# EasyEDA schematic 1-Schematic_ISMWAVER315_MODULE.json
TITLE: Sheet_1; REV: 1.0; Date: 2022-12-25; Sheet: 1/1; Drawn By: maarnotto; Company: Your Company
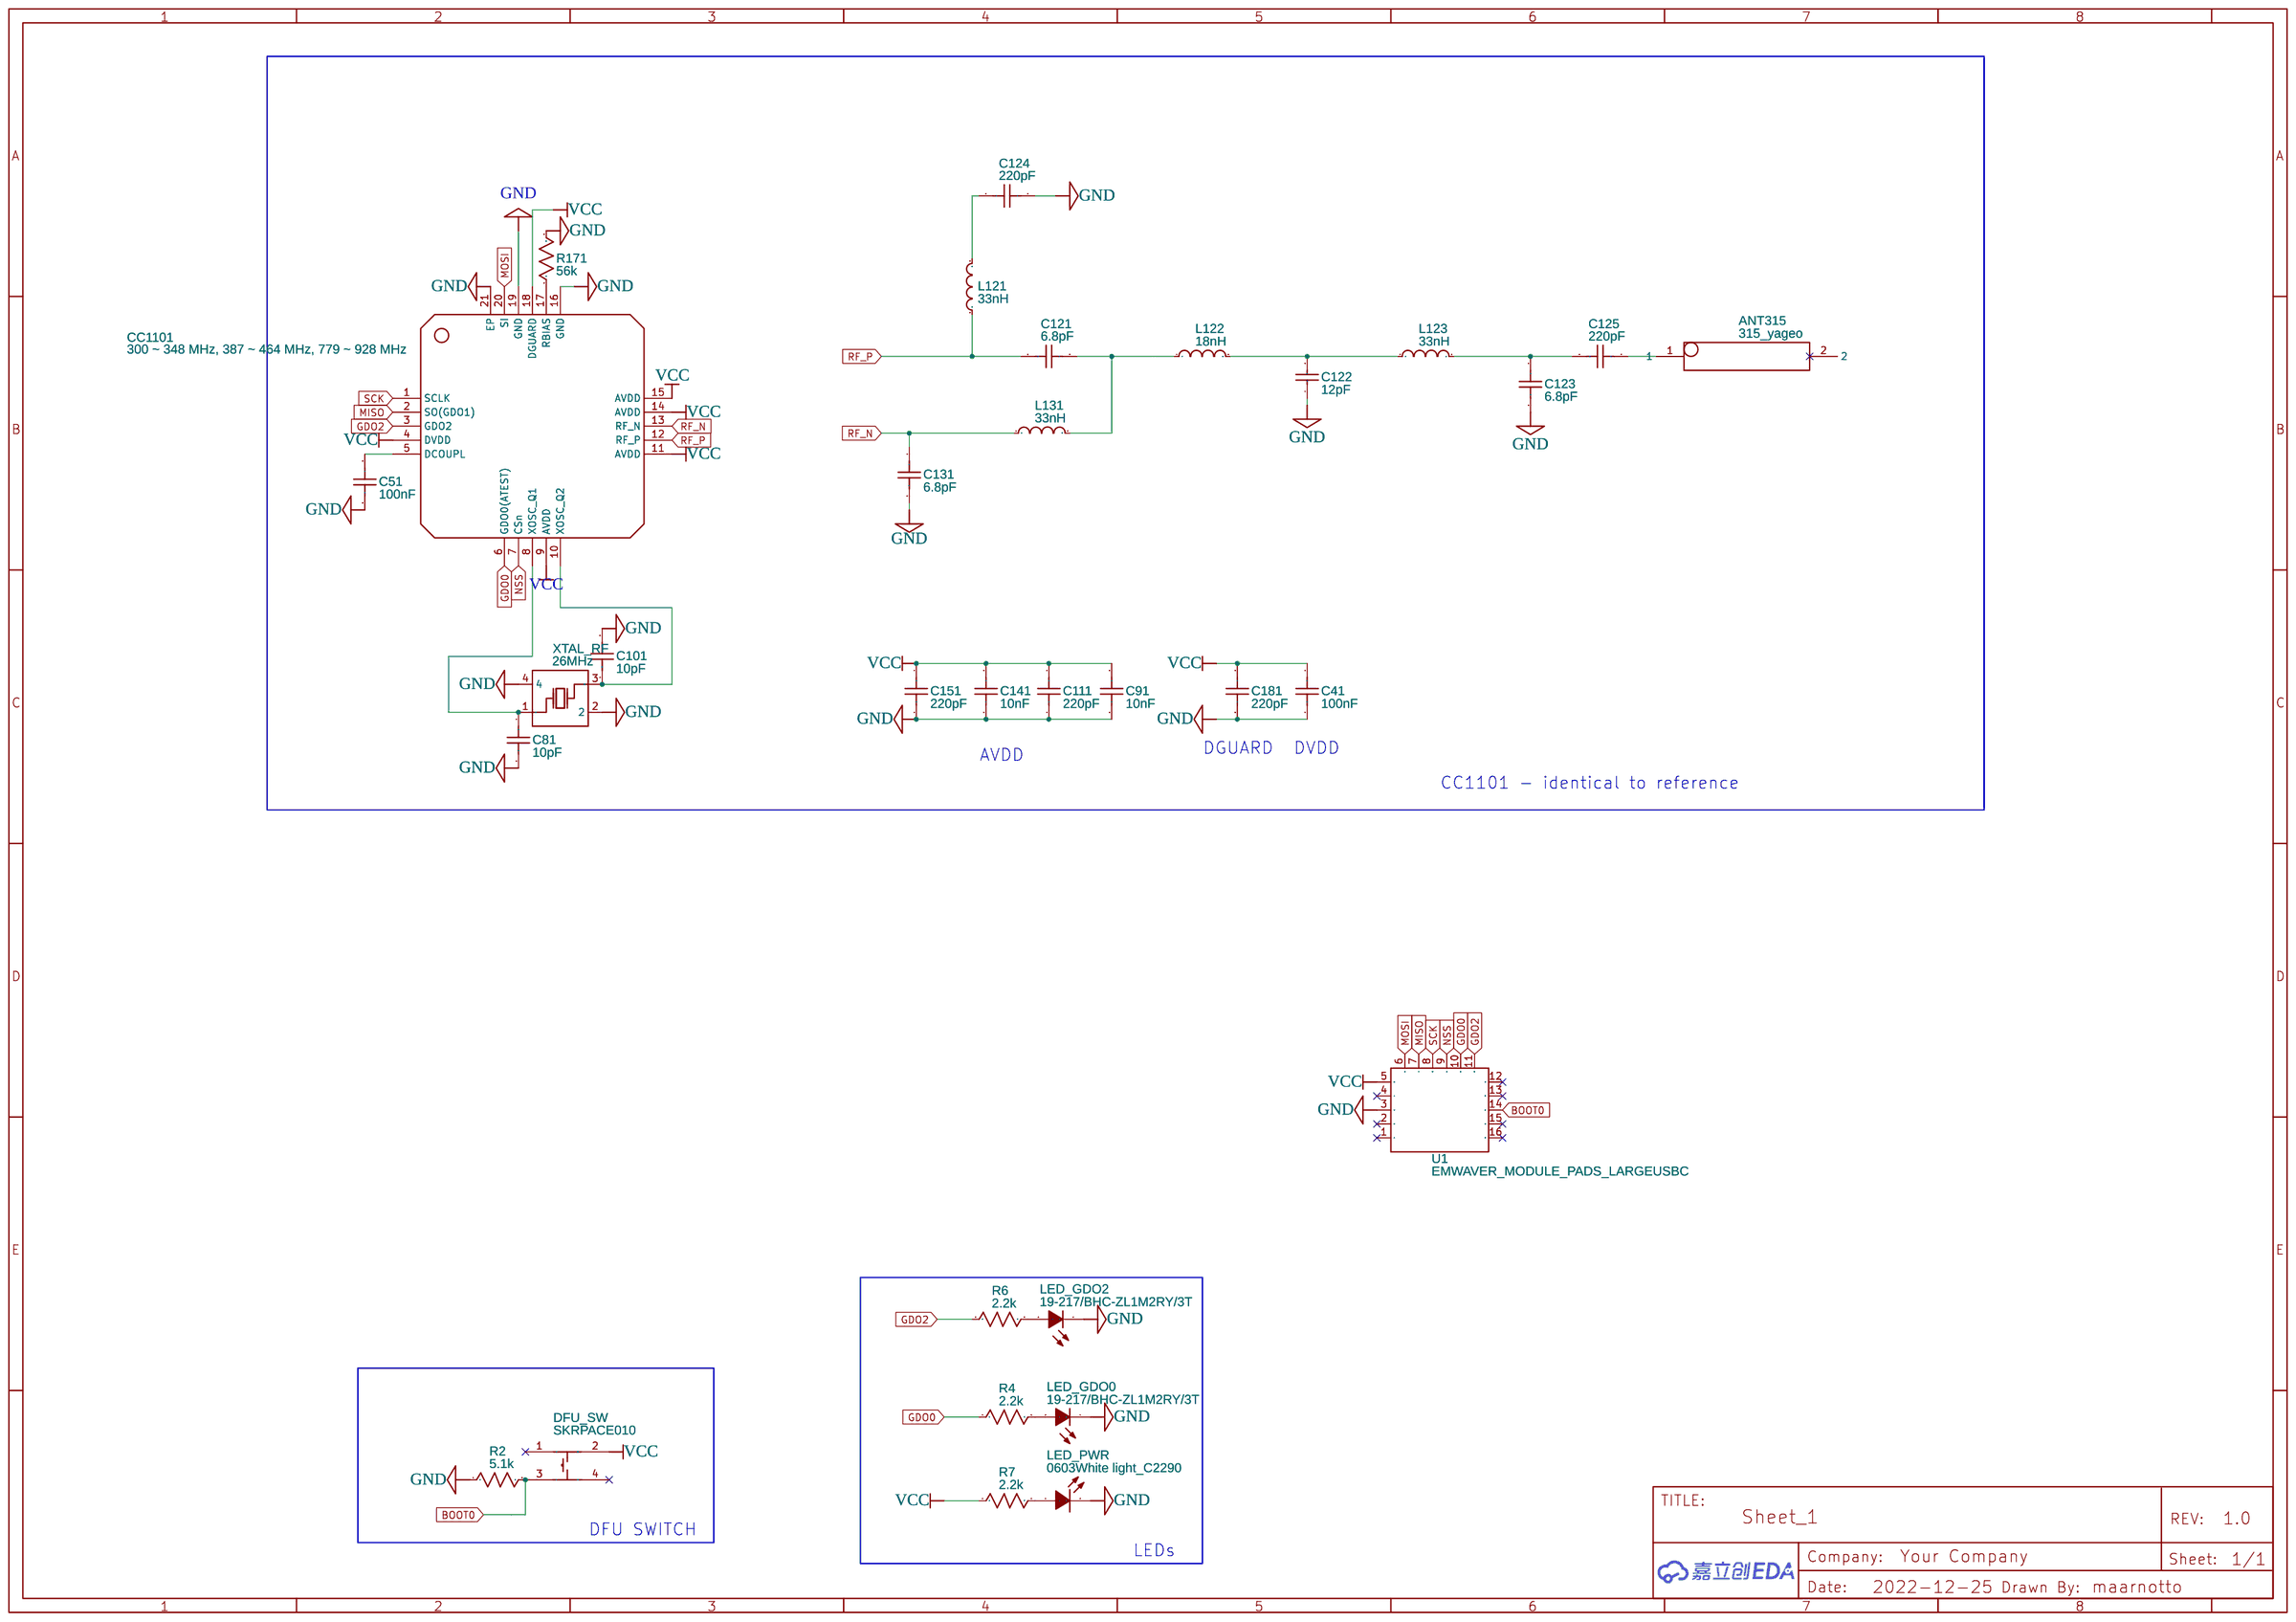
[diagram p0: schematic sheet]

## Parts
ANT315  315_yageo  [315_YAGEO]
C41  100nF  [C0402]
C51  100nF  [C0402]
C81  10pF  [C0402]
C91  10nF  [C0402]
C101  10pF  [C0402]
C111  220pF  [C0402]
C121  6.8pF  [C0402]
C122  12pF  [C0402]
C123  6.8pF  [C0402]
C124  220pF  [C0402]
C125  220pF  [C0402]
C131  6.8pF  [C0402]
C141  10nF  [C0402]
C151  220pF  [C0402]
C181  220pF  [C0402]
CC1101  300 ~ 348 MHz, 387 ~ 464 MHz, 779 ~ 928 MHz  [QFN-20_L4.0-W4.0-P0.5-TL-EP]
DFU_SW  SKRPACE010  [KEY-SMD_4P-L4.2-W3.2-P2.20-LS4.6]
L121  33nH  [L0402]
L122  18nH  [L0402]
L123  33nH  [L0402]
L131  33nH  [L0402]
LED_GDO0  19-217/BHC-ZL1M2RY/3T  [LED0603-RD]
LED_GDO2  19-217/BHC-ZL1M2RY/3T  [LED0603-RD]
LED_PWR  0603White light_C2290  [LED0603-R-RD_WHITE]
R2  5.1k  [R0603]
R4  2.2k  [R0603]
R6  2.2k  [R0603]
R7  2.2k  [R0603]
R171  56k  [R0402]
U1  EMWAVER_MODULE_PADS_LARGEUSBC  [EMWAVER_MODULE_PADS_FOOTPRINT_LARGEUSBC]
XTAL_RF  26MHz  [CRYSTAL-SMD_4P-L3.2-W2.5-BL]

## Library data of the parts
ANT315 = 315_yageo: Manufacturer: PULSE ELECTRONICS; Manufacturer Part: ANT1204F002R0315A; Supplier: LCSC; Supplier Part: C3284059; link: https://jlcpcb.com/partdetail/PulseElectronics-ANT1204F002R0315A/C3284059; Contributor: maarnotto
C41 C51 C81 C91 C101 C111 C121 C123-C125 C131 C141 C151 C181 = C_0402_US: Contributor: LCEDA_Lib
C122 = 0402CG8R2C500NT: Supplier: LCSC; Manufacturer: FH(风华); Supplier Part: C1579; JLCPCB Part Class: Extended Part
CC1101 = CC1101RGPR: Supplier: LCSC; Manufacturer: TI(德州仪器); Supplier Part: C29953; JLCPCB Part Class: Extended Part
DFU_SW = SKRPACE010: Contributor: LCSC; Supplier: LCSC; Manufacturer: ALPSALPINE(阿尔卑斯阿尔派); Supplier Part: C139797; JLCPCB Part Class: Extended Part
L121-L123 L131 = L0402_US: Supplier Part: C14033; Contributor: LCEDA_Lib
LED_GDO0 LED_GDO2 = 19-217/BHC-ZL1M2RY/3T: Supplier: LCSC; Manufacturer: EVERLIGHT(亿光); Supplier Part: C72041; JLCPCB Part Class: Basic Part
LED_PWR = 0603White light_C2290: Supplier: LCSC; Manufacturer: null; Manufacturer Part: KT-0603白灯; Supplier Part: C2290; JLCPCB Part Class: Basic Part
R2 R4 R6 R7 = R_0603_US: Contributor: LCEDA_Lib
R171 = R_0402_US: Contributor: LCEDA_Lib
U1 = EMWAVER_MODULE_PADS_LARGEUSBC: Contributor: maarnotto
XTAL_RF = 3S26000333: Supplier: LCSC; Supplier Part: C431163; Manufacturer: YL(惠伦晶体); Contributor: LCSC; JLCPCB Part Class: Extended Part

## Nets
GND: C41.2 C51.2 C81.2 C91.2 C101.2 C111.2 C122.1 C123.2 C124.1 C131.2 C141.2 C151.2 C181.2 CC1101.16(GND) CC1101.19(GND) CC1101.21(EP) LED_GDO0.1(C) LED_GDO2.1(C) LED_PWR.2(K) R2.1 R171.2 U1.3 XTAL_RF.2 XTAL_RF.4
VCC: C41.1 C91.1 C111.1 C141.1 C151.1 C181.1 CC1101.4(DVDD) CC1101.9(AVDD) CC1101.11(AVDD) CC1101.14(AVDD) CC1101.15(AVDD) CC1101.18(DGUARD) DFU_SW.2 R7.1 U1.5
BOOT0: DFU_SW.3 R2.2 U1.14
GDO0: CC1101.6(GDO0(ATEST)) R4.1 U1.10
GDO2: CC1101.3(GDO2) R6.1 U1.11
MISO: CC1101.2(SO(GDO1)) U1.7
MOSI: CC1101.20(SI) U1.6
NSS: CC1101.7(CSn) U1.9
RF_N: C131.1 CC1101.13(RF_N) L131.1
RF_P: C121.2 CC1101.12(RF_P) L121.1
SCK: CC1101.1(SCLK) U1.8
Net-(ANT315-1): ANT315.1 C125.1
Net-(C51-1): C51.1 CC1101.5(DCOUPL)
Net-(C81-1): C81.1 CC1101.8(XOSC_Q1) XTAL_RF.1(OSC1)
Net-(C101-1): C101.1 CC1101.10(XOSC_Q2) XTAL_RF.3(OSC2)
Net-(C121-1): C121.1 L122.1 L131.2
Net-(C122-2): C122.2 L122.2 L123.1
Net-(C123-1): C123.1 C125.2 L123.2
Net-(C124-2): C124.2 L121.2
Net-(CC1101-17): CC1101.17(RBIAS) R171.1
Net-(LED_GDO0-2): LED_GDO0.2(A) R4.2
Net-(LED_GDO2-2): LED_GDO2.2(A) R6.2
Net-(LED_PWR-1): LED_PWR.1(A) R7.2

Not connected (* = marked no-connect by the designer): ANT315 2*; DFU_SW 1* 4*; U1 1* 2* 4* 12* 13* 15* 16*

## Notes on the sheet
- AVDD
- DGUARD
- DVDD
- CC1101 - identical to reference
- DFU SWITCH
- LEDs
